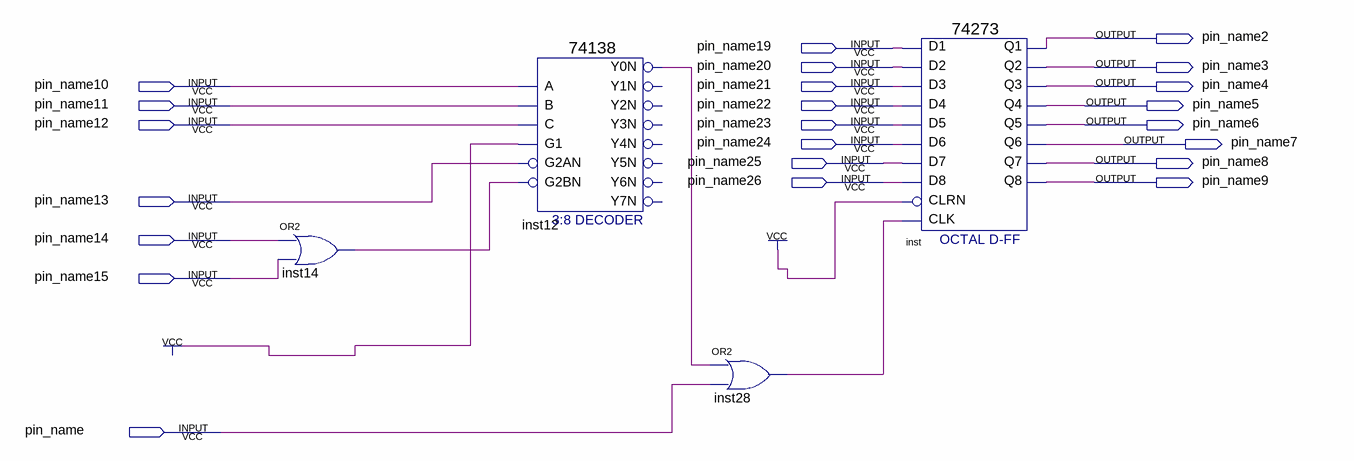
[diagram p0: schematic sheet]
// Quartus schematic Block1.bdf as structural Verilog: 4 symbols, 23 pins
module Block1 (
  input  pin_name19,
  input  pin_name20,
  input  pin_name10,
  input  pin_name21,
  input  pin_name11,
  input  pin_name22,
  input  pin_name12,
  input  pin_name23,
  input  pin_name24,
  input  pin_name25,
  input  pin_name26,
  input  pin_name13,
  input  pin_name14,
  input  pin_name15,
  input  pin_name,
  output pin_name2,
  output pin_name3,
  output pin_name4,
  output pin_name5,
  output pin_name6,
  output pin_name7,
  output pin_name8,
  output pin_name9
);

  wire inst12_y0n, inst14_out, inst28_out;

  or inst14 (inst14_out, pin_name14, pin_name15);
  \74138  inst12 (
    .A(pin_name10), .B(pin_name11), .G1(1'b1), .C(pin_name12), .G2AN(pin_name13), .G2BN(inst14_out),
    .Y0N(inst12_y0n));  // open: Y1N, Y2N, Y3N, Y4N, Y5N, Y6N, Y7N
  or inst28 (inst28_out, inst12_y0n, pin_name);
  \74273  inst (
    .D2(pin_name20), .D3(pin_name21), .D1(pin_name19), .D4(pin_name22), .D7(pin_name25), .D6(pin_name24),
    .D5(pin_name23), .D8(pin_name26), .CLK(inst28_out), .CLRN(1'b1), .Q4(pin_name5), .Q1(pin_name2),
    .Q2(pin_name3), .Q3(pin_name4), .Q6(pin_name7), .Q5(pin_name6), .Q7(pin_name8), .Q8(pin_name9));
endmodule
